# EAGLE design schematc (EAGLE 9.6.1)
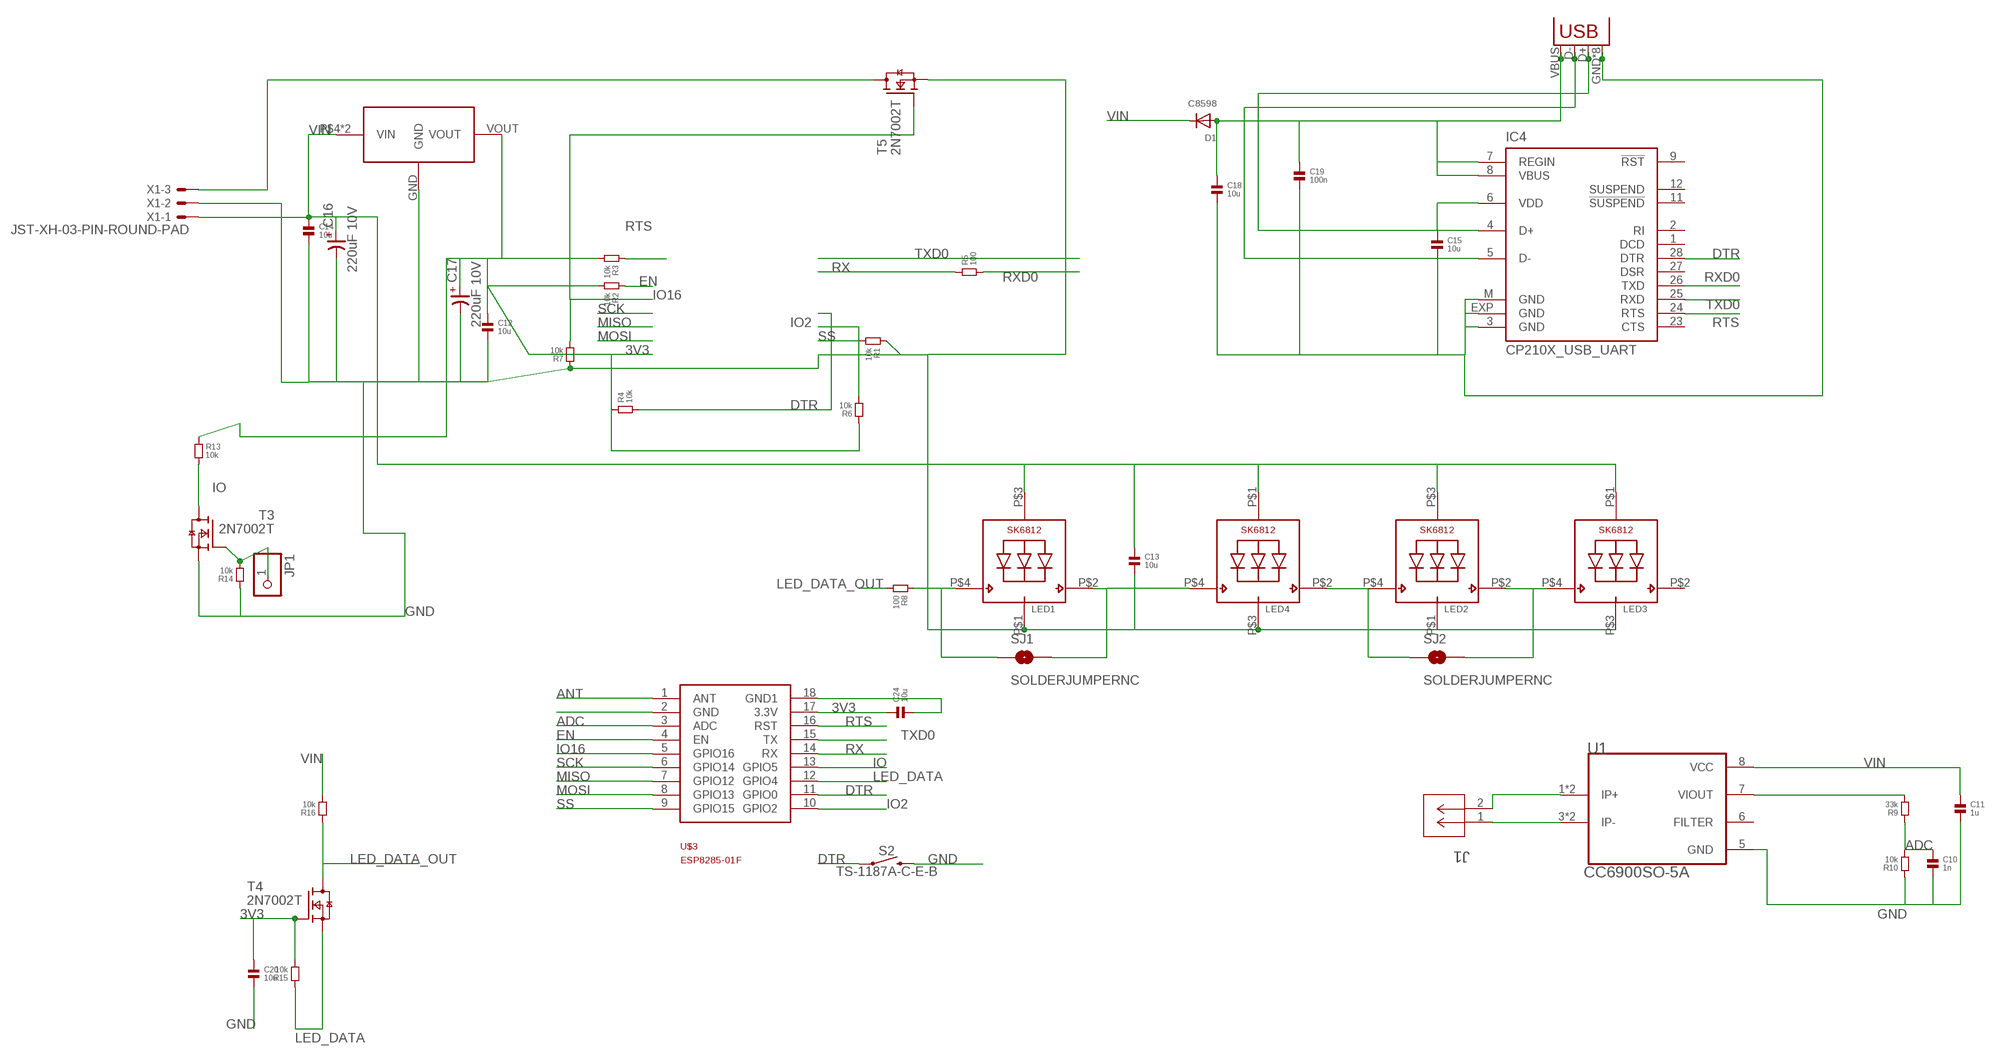
[diagram p0: schematic, sheet 1, part 1 of 2]
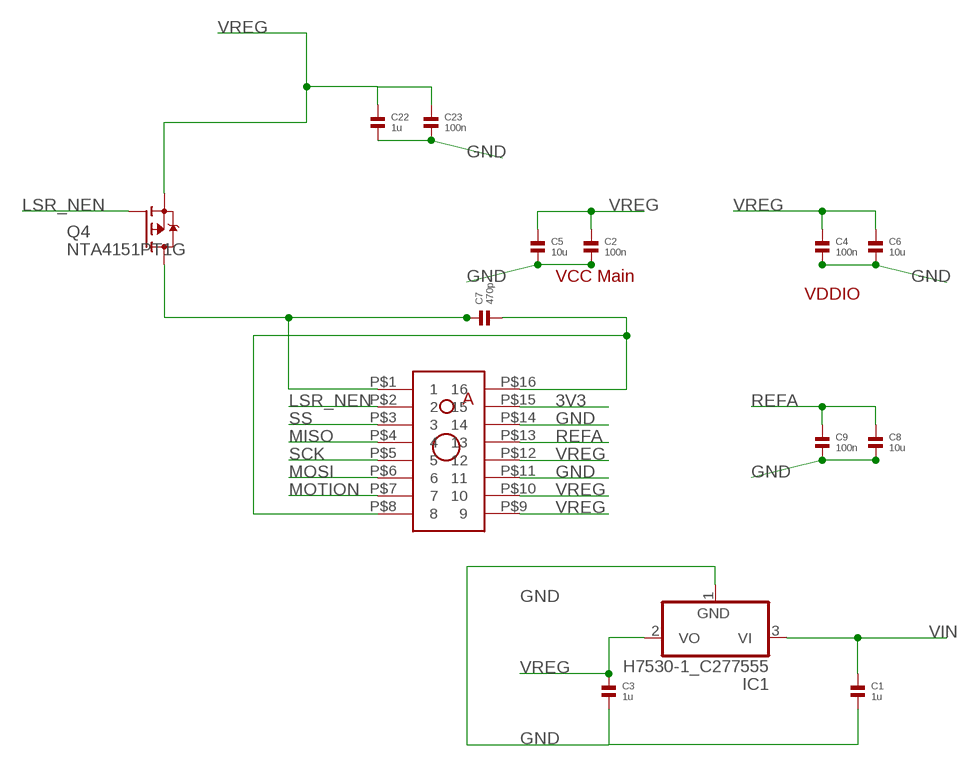
[diagram p1: schematic, sheet 1, part 2 of 2]

## Parts
C1  1u  CAPACITOR.0402  [0402]
C2  100n  CAPACITOR.0402  [0402]
C3  1u  CAPACITOR.0402  [0402]
C4  100n  CAPACITOR.0402  [0402]
C5  10u  CAPACITOR.0402  [0402]
C6  10u  CAPACITOR.0402  [0402]
C7  470p  CAPACITOR.0402  [0402]
C8  10u  CAPACITOR.0402  [0402]
C9  100n  CAPACITOR.0402  [0402]
C10  1n  CAPACITOR.0402  [0402]
C11  1u  CAPACITOR.0402  [0402]
C12  10u  CAPACITOR.0402  [0402]
C13  10u  CAPACITOR.0402  [0402]
C14  10u  CAPACITOR.0402  [0402]
C15  10u  CAPACITOR.0402  [0402]
C16  220uF 10V  CP-3258-TE-B  [3528-TE-B]
C17  220uF 10V  CP-3258-TE-B  [3528-TE-B]
C18  10u  CAPACITOR.0402  [0402]
C19  100n  CAPACITOR.0402  [0402]
C20  10u  CAPACITOR.0402  [0402]
C22  1u  CAPACITOR.0402  [0402]
C23  100n  CAPACITOR.0402  [0402]
C24  10u  CAPACITOR.0402  [0402]
D1  C8598  DIODESOD-123  [SOD-123]
IC1  H7530-1_C277555  MCP1703CB  [SOT23]
IC4  CP210X_USB_UART  [MLP28]
J1  JST  S2B-PH-K-S(LF)(SN)  [CONN_S2B-PH-K-S_JST]
JP1  PINHD-1X1CB  [1X01-CLEANBIG]
LED1  SK6812_SIDE  [LEDSIDE]
LED2  SK6812_SIDE  [LEDSIDE]
LED3  SK6812_2020  [_2020]
LED4  SK6812_2020  [_2020]
Q4  NTA4151PT1G  BSA223SP  [SC75_INFINEON]
R1  10k  RESISTOR.0402  [0402]
R2  10k  RESISTOR.0402  [0402]
R3  10k  RESISTOR.0402  [0402]
R4  10k  RESISTOR.0402  [0402]
R5  100  RESISTOR.0402  [0402]
R6  10k  RESISTOR.0402  [0402]
R7  10k  RESISTOR.0402  [0402]
R8  100  RESISTOR.0402  [0402]
R9  33k  RESISTOR.0402  [0402]
R10  10k  RESISTOR.0402  [0402]
R13  10k  RESISTOR.0402  [0402]
R14  10k  RESISTOR.0402  [0402]
R15  10k  RESISTOR.0402  [0402]
R16  10k  RESISTOR.0402  [0402]
S2  TS-1187A-C-E-B  MOMENTARY-SWITCH-SPST-SMD-5.2-REDUNDANT  [TACTILE_SWITCH_SMD_5.2MM]
SJ1  SOLDERJUMPERNC  [SJ_2S_SMALL]
SJ2  SOLDERJUMPERNC  [SJ_2S_SMALL]
T3  2N7002T  2N7002PT  [SOT416]
T4  2N7002T  2N7002PT  [SOT416]
T5  2N7002T  2N7002PT  [SOT416]
U1  CC6900SO-5A  ACS712ELCTR30AT  [SOIC127P600X175-8N]
U$1  AVAGO_ADNS-9500  [AVAGO_ADNS-9500]
U$3  ESP8285_ESP-01F01F  [ESP8285-01F]
U$5  ME6119  HT7333  [SOT89]
USB1  USBMICROB-PTH  [USB-MICROB-TH]
X1  JST-XH-03-PIN-ROUND-PAD  [JST-XH-03-PACKAGE-ROUND-PAD]

## Nets
3V3 [LED_Power]: C12.1 C17.+ C20.1 C24.1 R2.2 R3.2 R4.1 R6.1 R13.1 R15.2 T4.1(G) U$1.P$15 U$3.17(3.3V) U$5.VOUT
ADC: C10.1 R9.1 R10.2 U$3.3(ADC)
ANT: U$3.1(ANT)
DTR: IC4.28(DTR) R4.2 S2.1 S2.2 U$3.11(GPIO0)
EN: R2.1 U$3.4(EN)
GND: C1.2 C2.2 C3.2 C4.2 C5.2 C6.2 C8.2 C9.2 C10.2 C11.2 C12.2 C13.2 C14.2 C15.2 C16.- C17.- C18.2 C19.2 C20.2 C22.2 C23.2 C24.2 IC1.1(GND) IC4.3(GND) IC4.EXP(GND) IC4.M(GND) LED1.P$1(GND) LED2.P$1(GND) LED3.P$3(GND) LED4.P$3(GND) R1.1 R7.1 R10.1 R14.1 S2.3 S2.4 T3.2(S) T5.2(S) U1.5(GND) U$1.P$11 U$1.P$14 U$3.2(GND) U$3.18(GND1) U$5.GND USB1.GND USB1.ID(GND) USB1.M5(GND) USB1.M6(GND) USB1.MT1(GND) USB1.MT2(GND) USB1.MT3(GND) USB1.MT4(GND) X1.2
IO: R13.2 T3.3(D) U$3.13(GPIO5)
IO2: R6.2 U$3.10(GPIO2)
IO16: R7.2 T5.1(G) U$3.5(GPIO16)
LED_DATA: R15.1 T4.2(S) U$3.12(GPIO4)
LED_DATA_OUT: R8.2 R16.1 T4.3(D)
LSR_NEN: Q4.1(G) U$1.P$2
MISO: U$1.P$4 U$3.7(GPIO12)
MOSI: U$1.P$6 U$3.8(GPIO13)
MOTION: U$1.P$7
N$1: C7.2 U$1.P$8 U$1.P$16
N$2: C7.1 Q4.2(D) U$1.P$1
N$3: J1.2 U1.1(IP+) U1.2(IP+)
N$4: J1.1 U1.3(IP-) U1.4(IP-)
N$5: R9.2 U1.7(VIOUT)
N$6: LED1.P$2(DO) LED4.P$4(DI) SJ1.2
N$7: LED1.P$4(DI) R8.1 SJ1.1
N$8: LED2.P$2(DO) LED3.P$4(DI) SJ2.2
N$9: LED2.P$4(DI) LED4.P$2(DO) SJ2.1
N$10: JP1.1 R14.2 T3.1(G)
N$13: T5.3(D) X1.3
N$46: C18.1 C19.1 D1.A IC4.7(REGIN) IC4.8(VBUS) USB1.VBUS
N$48: C15.1 IC4.6(VDD)
N$52_N: IC4.5(D-) USB1.D-
N$52_P: IC4.4(D+) USB1.D+
REFA: C8.1 C9.1 U$1.P$13
RTS: IC4.24(RTS) R3.1 U$3.16(RST)
RX: R5.1 U$3.14(RX)
RXD0: IC4.26(TXD) R5.2
SCK: U$1.P$5 U$3.6(GPIO14)
SS: R1.2 U$1.P$3 U$3.9(GPIO15)
TXD0: IC4.25(RXD) U$3.15(TX)
VIN [3.3vPower]: C1.1 C11.1 C13.1 C14.1 C16.+ D1.C IC1.3(VI) LED1.P$3(VDD) LED2.P$3(VDD) LED3.P$1(VDD) LED4.P$1(VDD) R16.2 U1.8(VCC) U$5.P$4(VIN) U$5.VIN X1.1
VREG: C2.1 C3.1 C4.1 C5.1 C6.1 C22.1 C23.1 IC1.2(VO) Q4.3(S) U$1.P$9 U$1.P$10 U$1.P$12
Unconnected: IC4.1(DCD) IC4.2(RI) IC4.9(!RST) IC4.11(!SUSPEND) IC4.12(SUSPEND) IC4.23(CTS) IC4.27(DSR) LED3.P$2(DO) U1.6(FILTER)

## Notes on the sheet
- VCC Main
- VDDIO

## Library data of the parts
C1-C15 C18-C20 C22-C24 = standardparts:CAPACITOR
C16 C17 = cap-master:CP-: POLARIZED CAP
D1 = adafruit:DIODE: Diode SMADIODE - SMA Surface Mount Package 20V 1A Schottky Diode Digikey: 641-1014-6-ND DO-1N4148 - Through Hole Small Current Diode SOD-123 20V 1 A (.5mV Vf) Schottky Diode - Digikey: MBRX120TPMSCT-ND SOD-323 10V 570mA (.38mV Vf, 3ns) Schottky Diode - Digikey: ZLLS410CT-ND SOD-523 30V 30mA Schottky Diode (RB751S-40TE61) - Digikey: RB751S-40TE61CT-ND SOT23-R/W - SOT23 Package (R = Solder Paste/Reflow Ovens, W = Hand-Soldering) BAT54Film 40V 300mA - Digikey: 497-7162-1-ND
IC1 = linear:MCP1703: 250 mA, 16V, Low Quiescent Current LDO Regulator Source: http://ww1.microchip.com/downloads/en/DeviceDoc/22049b.pdf
IC4 = SparkFun-DigitalIC:CP210X_USB_UART: Single-Chip USB to UART Bridge Source: www.silabs.com .. CP2101.pdf / cp2102.pdf. Spark Fun Electronics SKU : COM-00310
J1 = 2mm_2Position_JST_RT_TH:S2B-PH-K-S(LF)(SN); BUILT_BY: EMA_Justin; COPYRIGHT: Copyright (C) 2018 Accelerated Designs. All rights reserved; DATASHEET: http://www.jst-mfg.com/product/pdf/eng/ePH.pdf; MANUFACTURER_PART_NUMBER: S2B-PH-K-S(LF)(SN); SOURCELIBRARY: JST_2020-03-24; VENDOR: JST
JP1 = adafruit:PINHD-1X1: Pin header 1x1 for 0.1" spacing With round pins
LED1-LED4 = SK6812:SK6812
Q4 = BSA223SP:BSA223SP: OptiMOS(R)-P Small-Signal-Transistor P-Channel, Enhancement mode, Super Logic Level (2.5 V rated) Source: http://www.infineon.com/upload/Document/BSA223SP_Rev1.3.pdf; AVAILABILITY: Unavailable; DESCRIPTION: P-Channel 20V 390mA _Ta_ 250mW _Ta_ Surface Mount PG-SC-75; MF: Infineon Technologies; MP: BSA223SP; PACKAGE: SOT-416 Infineon Technologies; PRICE: None
R1-R10 R13-R16 = standardparts:RESISTOR
S2 = SparkFun-Switches:MOMENTARY-SWITCH-SPST: Momentary Switch (Pushbutton) - SPST Normally-open (NO) SPST momentary switches (buttons, pushbuttons). Variants PTH-12MM - 12mm square, through-hole Momentary Pushbutton Switch - 12mm Square <https://www.sparkfun.com/products/9190> (COM-09190) PTH-6.0MM, PTH-6.0MM-KIT - 6.0mm square, through-hole Mini Pushbutton Switch <https://www.sparkfun.com/products/97> (COM-00097) KIT package intended for soldering kit's - only one side of pads' copper is exposed. PTH-RIGHT-ANGLE-KIT - Right-angle, through-hole Right Angle Tactile Button <https://www.sparkfun.com/products/10791> - Used on SparkFun BigTime Watch Kit <https://www.sparkfun.com/products/11734> SMD-12MM - 12mm square, surface-mount Tactile Button - SMD (12mm) <https://www.sparkfun.com/products/12993> (COM-12993) Used on SparkFun PicoBoard <https://www.sparkfun.com/products/11888> SMD-4.5MM - 4.5mm Square Trackball Switch Used on SparkFun Blackberry Trackballer Breakout <https://www.sparkfun.com/products/13169> SMD-4.6MMX2.8MM - 4.60mm x 2.80mm, surface mount Used on SparkFun SAMD21 Mini Breakout <https://www.sparkfun.com/products/13664> SMD-5.2MM, SMD-5.2-REDUNDANT - 5.2mm square, surface-mount Mini Pushbutton Switch - SMD <https://www.sparkfun.com/products/8720> (COM-08720) Used on Arduino Pro Mini <https://www.sparkfun.com/products/11114> REDUNDANT package connects both switch circuits together SMD-6.0X3.5MM - 6.0 x 3.5mm, surface mount Momentary Reset Switch SMD <https://www.sparkfun.com/products/8229> (COM-08229) SMD-6.2MM-TALL - 6.2mm square, surface mount Tactile Button - SMD (6mm) <https://www.sparkfun.com/products/12992> Used on SparkFun Digital Sandbox <https://www.sparkfun.com/products/12651> SMD-RIGHT-ANGLE - Right-angle, surface mount Used on SparkFun Block for Intel® Edison - Arduino <https://www.sparkfun.com/products/13036>; PROD_ID: SWCH-08247; SF_SKU: COM-08720
SJ1 SJ2 = headers:SOLDERJUMPER: Solder Jumper Standard SMD solder jumper. Used to automate production. Two varients : Normally Open and Normally Closed are the same, but have different paste layers. NC will have a large amount of paste and should jumper during reflow.
T3-T5 = nxp_60:2N7002: N-channel TrenchMOS FET N-channel enhancement mode Field-Effect Transistor (FET) in a plastic package using TrenchMOS technology. AAL Eindhoven MK
U1 = ACS712ELCTR30AT:ACS712ELCTR30AT: Sensor: current; Package: SO8; Usup: 4.5÷5.5VDC; Iin: ± 30A; 66mV; AVAILABILITY: Unavailable; DESCRIPTION: Current Sensor 30A 1 Channel Hall Effect, Open Loop Bidirectional 8-SOIC _0.154, 3.90mm Width_; MF: Allegro MicroSystems LLC; MP: ACS712ELCTR30AT; PACKAGE: SOIC-8 Allegro MicroSystems LLC; PRICE: None
U$1 = JKCustom:AVAGO_ADNS-9500
U$3 = ESP8266-ESP12:ESP8285_ESP-01F
U$5 = HT7333_SOT89:HT7333
USB1 = Ai_Connectors:USB
X1 = JST XH Connectors v1-0:JST-XH-03-PIN: JST XH Connector 2 Pin Wire to board connector. Pitch: 2,54 mm, (0.100") Number of pins: 3 Created by Rembrandt Electronics www.rembrandtelectronics.com

## Net classes
2 LED_Power: width 0.178 mm, clearance 0.127 mm
3 3.3vPower: width 0.178 mm

## Board
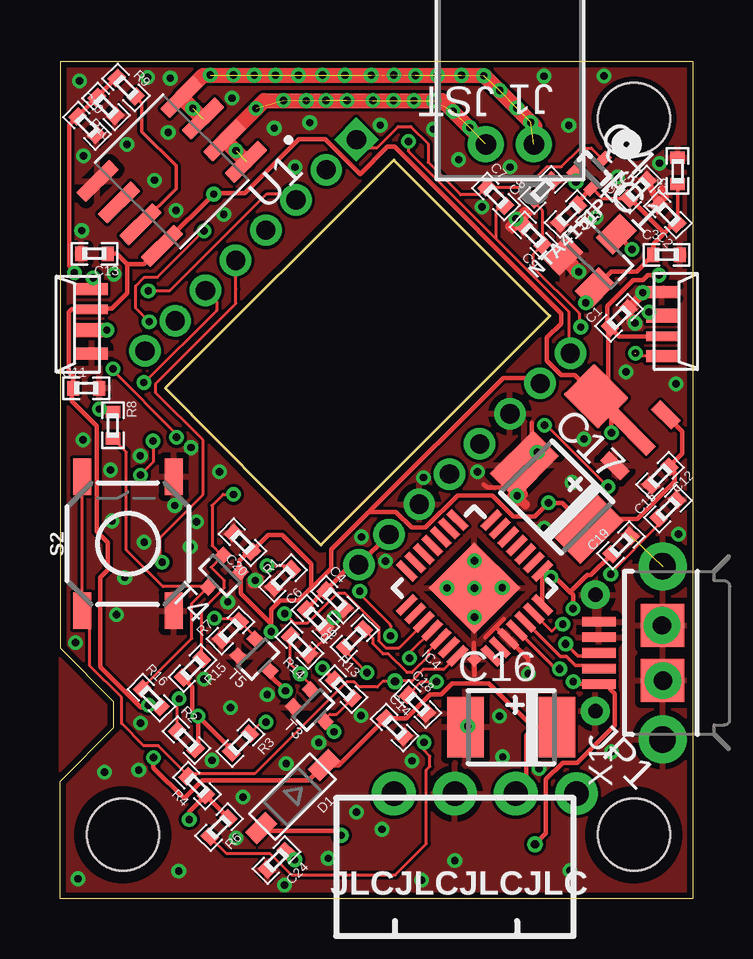
[diagram p2: board, top side]
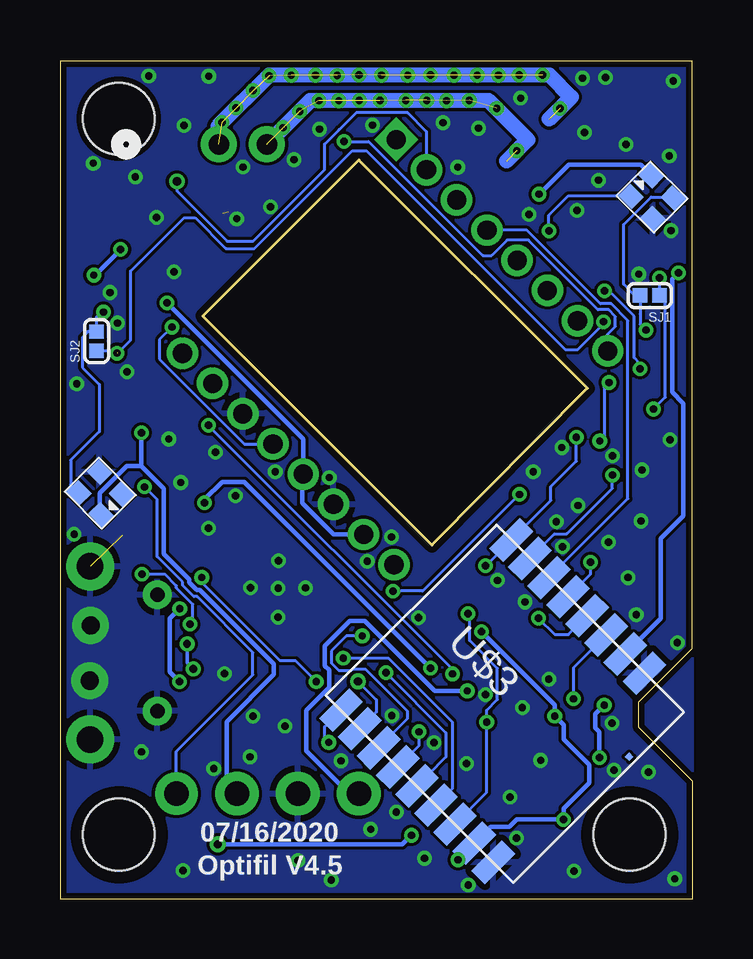
[diagram p3: board, bottom side, seen from below]

Size 26.37 x 34.91 mm. Coordinates in mm from the lower left corner, seen from the top.
Outline: 0.03,34.91 26.36,34.91 26.36,0 0,0 0,4.89 2.25,7.14 2.25,8.21 0.03,10.43 0.03,34.91
Copper layers (1*16): Top 0.035mm / dielectric 1.5mm / Bottom 0.035mm
Design rules "LP_PCBOrder": minimum track width 5mil, minimum drill 12mil, track to track 5mil, track to pad 5mil, pad to pad 5mil, via to via 5mil, smd to smd 0mil, copper to edge 10mil, drill to drill 10mil, minimum pad ring 10mil, minimum via ring 6mil, stop-mask expansion 2mil, vias tented up to drill 17mil, thermal gap 10mil
Holes 3 mm at 2.63,2.67 23.92,2.67 23.92,32.52
tRestrict: area 2.3,2.4 to 2.9,3; area 23.6,2.4 to 24.2,3; area 4.1,14.4 to 20.7,31
bRestrict: area 2.3,2.4 to 2.9,3; area 23.6,2.4 to 24.2,3; area 4.1,14.4 to 20.7,31

### Footprints (pad centres in the part's own frame; a part is rotated, then mirrored left to right if it is on the bottom)
0402 = smd 0.5 x 0.6: 1 -0.55,0; 2 0.55,0
3528-TE-B = smd 1.524 x 2.54: + 1.905,0; - -1.905,0
SOD-123 = smd 1.2 x 0.7: A 1.85,0; C -1.85,0
SOT23 = smd 1 x 1.4: 1 -0.95,-1.1; 2 0.95,-1.1; 3 0,1.1
MLP28 = smd 1 x 0.3: 1 -2.5,1.5; 2 -2.5,1; 3 -2.5,0.5; 4 -2.5,0; 5 -2.5,-0.5; 6 -2.5,-1; 7 -2.5,-1.5; 15 2.5,-1.5; 16 2.5,-1; 17 2.5,-0.5; 18 2.5,0; 19 2.5,0.5; 20 2.5,1; 21 2.5,1.5 | smd 0.3 x 1: 8 -1.5,-2.5; 9 -1,-2.5; 10 -0.5,-2.5; 11 0,-2.5; 12 0.5,-2.5; 13 1,-2.5; 14 1.5,-2.5; 22 1.5,2.5; 23 1,2.5; 24 0.5,2.5; 25 0,2.5; 26 -0.5,2.5; 27 -1,2.5; 28 -1.5,2.5 | smd 2.7 x 2.7: EXP 0,0 | smd 0.435 x 0.435: M -2.103,2.103
CONN_S2B-PH-K-S_JST = drill 0.85 pad 1.5: 1 0,0; 2 2.007,0
1X01-CLEANBIG = drill 1.016 pad 1.778: 1 0,0
LEDSIDE = smd 1.3 x 0.5: P$1 -0.212,1.905; P$4 -0.212,-0.77 | smd 1.3 x 0.6: P$2 -0.212,0.927 | smd 1.3 x 0.4: P$3 -0.212,0.058
_2020 = smd 0.8 x 0.7: P$1 0.65,-0.6; P$2 0.65,0.6; P$3 -0.65,0.6; P$4 -0.65,-0.6
SC75_INFINEON = smd 0.4 x 0.65: 1 -0.5,-0.575; 2 0,0.575; 3 0.5,-0.575
TACTILE_SWITCH_SMD_5.2MM = smd 1.524 x 0.762: 1 -2.794,1.905; 2 2.794,1.905; 3 -2.794,-1.905; 4 2.794,-1.905
SJ_2S_SMALL = smd 0.6 x 0.6: 1 -0.4,0; 2 0.4,0
SOT416 = smd 0.5 x 0.6: 1 -0.5,-0.65; 2 0.5,-0.65; 3 0,0.65
SOIC127P600X175-8N = smd 1.97 x 0.6: 1 -2.475,1.905; 2 -2.475,0.635; 3 -2.475,-0.635; 4 -2.475,-1.905; 5 2.475,-1.905; 6 2.475,-0.635; 7 2.475,0.635; 8 2.475,1.905
AVAGO_ADNS-9500 = drill 0.8 pad 1.3 square: P$1 0,0 | drill 0.8 pad 1.3: P$2 -1.78,0; P$3 -3.56,0; P$4 -5.34,0; P$5 -7.12,0; P$6 -8.9,0; P$7 -10.68,0; P$8 -12.46,0; P$9 -12.46,-12.6; P$10 -10.68,-12.6; P$11 -8.9,-12.6; P$12 -7.12,-12.6; P$13 -5.34,-12.6; P$14 -3.56,-12.6; P$15 -1.78,-12.6; P$16 0,-12.6
ESP8285-01F = smd 0.254 x 0.254: 1 -4.701,-0.696 | smd 1.778 x 0.8: 2 -7.624,-2.709; 3 -7.624,-3.834; 4 -7.624,-4.96; 5 -7.624,-6.085; 6 -7.624,-7.21; 7 -7.624,-8.335; 8 -7.624,-9.46; 9 -7.624,-10.553; 10 2.407,-10.553; 11 2.407,-9.46; 12 2.407,-8.335; 13 2.407,-7.21; 14 2.407,-6.085; 15 2.407,-4.96; 16 2.407,-3.834; 17 2.407,-2.709; 18 2.407,-1.585
SOT89 = smd 0.559 x 1.194: GND -1.499,-0.597; VOUT 1.499,-0.597 | smd 1.829 x 2.032: P$4 0,2.007 | smd 0.559 x 2.286: VIN 0,-0.089
USB-MICROB-TH = smd 0.4 x 1.4: D+ 0,2.65; D- -0.65,2.65; GND 1.3,2.65; ID 0.65,2.65; VBUS -1.3,2.65 | smd 1.8 x 1.8: M5 -1.15,0; M6 1.15,0 | drill 0.6 pad 1.2: MT1 -2.425,2.8; MT2 2.425,2.8 | drill 1.1 pad 2: MT3 -3.61,0; MT4 3.61,0
JST-XH-03-PACKAGE-ROUND-PAD = drill 1.016 pad 1.829: 1 -2.54,0; 2 0,0; 3 2.54,0

### Placement (x,y rotation side)
C1  23.3,24.22 45 top
C2  25.33,28.52 135 top
C3  25.28,26.84 0 top
C4  11.45,12.46 315 top
C5  25.73,30.34 90 top
C6  10.64,11.68 315 top
C7  18.16,29.27 315 top
C8  20.11,29.54 45 top
C9  19.72,27.64 135 top
C10  1.12,32.22 315 top
C11  1.09,21.28 0 top
C12  25,17.62 225 top
C13  1.44,26.89 180 top
C14  13.94,7.13 315 top
C15  25.32,16.24 45 top
C16  18.8,7.15 0 top
C17  20.7,16.74 315 top
C18  14.89,8.11 315 top
C19  23.38,14.74 45 top
C20  7.6,14.86 135 top
C22  24.09,29.57 45 top
C23  21.19,28.54 225 top
C24  9.02,1.6 225 top
D1  9.69,4.25 225 top
IC1  22.4,26.92 315 top
IC4  17.27,12.95 135 top
J1  19.75,31.45 180 top
JP1  21.52,4.38 315 top
LED1  1.12,24.63 180 top
LED2  25.29,23.38 0 top
LED3  24.69,16.9 315 bottom
LED4  1.7,29.25 135 bottom
Q4  22.22,30.4 315 top
R1  9.28,13.35 45 top
R2  5.27,6.62 315 top
R3  7.52,6.49 225 top
R4  5.7,4.71 135 top
R5  12.26,10.85 45 top
R6  6.63,2.97 225 top
R7  7.1,11.17 45 top
R8  2.2,19.73 270 top
R9  2.75,33.83 315 top
R10  1.92,33.02 135 top
R13  11.8,8.74 315 top
R14  9.98,10.57 135 top
R15  5.52,9.61 225 top
R16  3.8,8.37 315 top
S2  2.83,14.8 90 top
SJ1  1.79,25.15 180 bottom
SJ2  24.84,23.24 90 bottom
T3  10.56,7.87 225 top
T4  6.66,13.47 135 top
T5  8.26,9.99 225 top
U1  4.66,30.32 225 top
U$1  12.35,31.64 45 top
U$3  5.49,2.1 225 bottom
U$5  23.76,19.53 45 top
USB1  25.11,10.25 90 top
X1  16.45,4.38 180 top

### Tracks (layer width: path | path; a pad name or v marks a point on that pad's centre or on a via)
3V3  (via drill 0.3, 0.3 pad 0.61)
  Top 0.178: v8.8,11.13 8.8,11.46 | 8.8,11.46 8.8,12.06 9.17,12.43 9.96,12.43 11.29,13.77 11.29,14.55 12.87,16.13 12.92,16.13 | 12.92,16.13 14,16.13 14.66,15.46 15.23,15.46 16.57,16.81 18.01,16.81 18.89,15.93 19.78,15.93 v20.35,16.5 20.93,16.5 C17.+ 22.46,14.97 23.32,15.84 24.06,15.84 25.61,17.39 25.61,17.79 C12.1 25.93,18.55 25.93,19.47 U$5.VOUT | R3.2 7.13,6.23 v5.75,7.61 | v10.93,9.61 R13.1 | R6.1 6.09,4.29 R4.1 5.38,3.62 v5.38,3.3 | 8.8,11.46 7.53,12.72 7.53,13.52 T4.1 7.48,14.09 7.86,14.47 C20.1 8.67,15.15 9.26,15.15 10.46,13.95 10.46,12.93 | C24.1 v9.77,1.62 v9.78,1.62 | v5.75,7.61 5.51,7.85 5.51,8.84 R15.2 | R2.2 5.75,6.32 v5.75,7.61 | R15.2 | U$1.P$15 19.77,21.71 18.46,21.71 12.92,16.17 12.92,16.13
  Bottom 0.178: v8.8,11.13 v8.8,11.12 5.75,8.08 v5.75,7.61 5.38,7.24 5.38,6.64 4.31,5.57 4.31,4.83 5.38,3.76 v5.38,3.3 7.34,3.3 7.64,3 8.42,3 U$3.17 9.78,1.64 v9.78,1.62 | v20.35,16.5 20.35,16.64 19.61,17.38 18.7,17.38 v10.93,9.61
ADC  (via drill 0.3)
  Top 0.178: R9.1 2.34,34.22 R10.2 C10.1 0.38,32.26 0.38,26.38 0.6,26.16 v0.6,26.09
  Bottom 0.178: U$3.3 1.33,11.68 1.33,15.01 0.39,15.95 0.39,20.65 0.86,21.12 0.86,25.82 v0.6,26.09
DTR  (via drill 0.35)
  Top 0.127: IC4.28 15.99,9.55 15.14,9.55 14.67,9.08 13.97,9.08 v13.95,9.06 13.45,9.06 13.22,8.83 12.46,8.83 12.26,9.03 11.94,9.03 8.12,5.21 5.42,5.21 R4.2 5.3,5.09 5.29,5.1 5.29,5.19 4.1,6.38 3.49,6.38 2.57,7.3 2.57,8.38 1.24,9.7 1.24,11.68 S2.1 S2.2
  Bottom 0.127: U$3.11 13.18,7.78 13.18,8.29 v13.95,9.06
EN  (via drill 0.3)
  Top 0.127: R2.1 4.88,8.24 v4.97,8.33
  Bottom 0.127: v4.97,8.33 4.97,9.64 U$3.4
GND  (via drill 0.3 pad 0.61, 0.76 pad 1.52)  (2 unrouted)
  Top 0.127: C6.2 11.25,11.06 R14.1 | 24.69,17.15 C12.2 | USB1.GND 22.43,11.52 | 20.59,29.84 C8.2
  Top 0.178: 18.5,11.66 18.16,11.33 | 17.73,10.89 18.16,11.33 | 17.65,17.27 17.79,17.13 18.4,17.13 C17.- 19.66,18.39 19.66,19.85 | 18.83,27.8 19.58,28.55 | v19.51,9.39 19.51,10 IC4.3 18.66,10.83 18.16,11.33 | IC4.M 17.27,9.34 17.27,9.33 17.25,10.67
  Top 0.2: v19,28.35 19,28.13 18.9,28.03 18.76,28.03
  Top 0.305: 7.99,13.1 8.18,13.1 8.34,13.25 8.32,13.27 8.32,13.37 | C2.2 C22.2 | 25.21,29.24 25.09,29.59
  Top 0.381: 19.41,16.42 19.24,16.59 19.04,16.59 19.32,16.87 19.23,16.96 19.08,16.96 18.88,16.76 18.78,16.76 18.78,16.62 18.95,16.46 | C1.2 23.69,24.63 24.24,25.18 24.46,25.32 LED2.P$1
  Top 0.406: 19.35,28.63 18.76,28.03
  Top 0.61: 21.58,26.15 21.21,26.52 | 23.99,23.96 23.9,24.05
  other vias: 6.99,12.37 18.32,7.61 12.35,3.61 15.07,0.78 13.56,14.07 25.77,15.19 13.42,2.89 17.27,14.09 16.13,12.95 19.89,18.61 23.58,21.96 6.65,17.79 7.34,2.53 11.42,11.71 2.79,31.44 7.17,33.37 10.41,32.35 4.6,34.2 0.75,0.83 8.14,13.27 2.35,11.84 2.11,17.87 20.18,15.44 22.97,6.12 15.56,32.08 18.43,12.96 17.28,11.74 2.16,15.74 0.64,10.67 16.45,1.59 21.25,1.17 17.27,12.95 25.09,11.39 25.12,9.09 16.99,7.2 19.05,16.8 8.93,32.12 8.64,8.51 7.62,4.23 7.1,7.97 0.91,27.85 3.64,34.23 24.98,30.66 23.23,30.09 12.56,15.08 17.4,17.79 4.51,31.94 0.82,34.09 4.95,1.15 1.85,5.27 9.79,30.49 9.35,0.56 6.34,5.77 4.78,16.39 6,9.15 3.36,7.32 3.28,5.36 2.7,13.39 5.68,15.71 14.66,5.74 12.54,7.64 11.18,1.68 9.42,5.64 10.78,6.5 19.96,5.42 18.44,5.91 17.59,28.84 0.95,19.12 6.82,28.52 3.34,18.46 3.51,14.86 5.42,14.68 13.35,32.25 5.46,18.81 16.61,30.81 18.74,30.5 21.2,32.23 20.17,34.29 22.67,34.3 21.84,19.16 21.33,17.35 15.15,17.55 25.67,21.47 22.34,28.4 21.61,26.13 23.96,23.99 2.25,26.03 24.28,25.26 4.83,28.69 0.98,30.96 3.93,29.95
  pour Top: 0,34.88 26.4,34.88 26.4,0.04 0,0.04
  pour Bottom: 0,34.88 26.4,34.88 26.4,0.04 0,0.04
IO  (via drill 0.3 pad 0.61)
  Top 0.127: R13.2 11.52,7.68 11.24,7.68 11.02,7.46 T3.3 11.41,7.01 v11.41,6.96
  Bottom 0.127: v11.41,6.96 11.41,6.37 U$3.13
IO2  (via drill 0.3)
  Top 0.127: R6.2 6.24,2.57 6.93,1.88 8.75,1.88 9.64,0.99 13.97,0.99 15.27,2.29 15.27,5.37 15.41,5.51 15.41,5.94 15.17,6.19 v15.17,6.52
  Bottom 0.127: U$3.10 14.94,7.57 15.34,7.17 15.34,6.69 v15.17,6.52
IO16  (via drill 0.3 pad 0.61)
  Top 0.127: v6.43,11.69 7.36,11.69 R7.2 8.16,10.89 T5.1
  Bottom 0.127: v6.43,11.69 5.75,11.01 5.18,11.01 4.83,11.36 | 4.83,11.36 | U$3.5 4.83,11.36
LED_DATA  (via drill 0.3 pad 0.61)
  Top 0.127: v12.49,12.82 12.49,12.7 13.74,11.45 13.74,11.42 13.77,11.38 v13.77,10.95 | v7.22,16.85 6.8,16.85 6.34,16.39 6.34,14.72 T4.2 6.29,13.81 6.85,13.26 6.85,12.95 5.91,12.02 R15.1
  Bottom 0.127: v12.49,12.82 11.25,12.82 v7.22,16.85 | v13.77,10.95 14.43,10.95 15.06,10.32 15.06,9.82 14.74,9.51 14.24,9.51 14.17,9.58 13.64,9.58 11.89,7.82 11.89,7.5 U$3.12
LED_DATA_OUT
  Top 0.127: R16.1 5.5,10.84 5.5,12.31 T4.3 4.28,13.01 2.76,14.53 2.76,18.62 R8.2
LSR_NEN  (via drill 0.35)
  Top 0.127: Q4.1 21.46,29.94 v21.49,29.9
  Bottom 0.127: v21.49,29.9 21.49,29.51 19.4,27.41 18.31,27.41 15.34,30.39 15.34,31.46 14.73,32.06 14.72,32.06 14.02,32.76 11.88,32.76 11.09,31.97 U$1.P$2
MISO
  Bottom 0.127: U$3.7 2.7,16.68 2.7,24.1 3.41,24.8 3.84,24.8 6.91,27.87 U$1.P$4
MOSI  (via drill 0.3, 0.3 pad 0.61)
  Top 0.127: v3.35,17.66 v3.35,17.67 3.9,18.22 3.9,19.08 v3.87,19.08 | U$1.P$6 6.53,24.88 6.53,24.52 3.52,21.51 v3.49,21.51
  Bottom 0.127: U$3.8 5.76,15.21 5.25,15.21 3.35,17.11 v3.35,17.66 | v3.87,19.08 3.7,19.25 3.7,21.31 v3.49,21.51
N$1  (via drill 0.3 pad 0.61)
  Top 0.127: 18.18,27.5 21.19,24.48 21.19,22.81 U$1.P$16 | 18.18,27.5 18.18,28.71 18.36,28.88 C7.2 | v14.53,31.57 14.53,31.15 18.18,27.5
  Bottom 0.127: v14.53,31.57 | v14.53,31.57 13.5,31.57 8.75,26.81 8.38,26.81 7.73,27.45 6.85,27.45 3.95,24.55 3.51,24.55 3.22,24.26 3.22,23.85 3.54,23.53 U$1.P$8
N$2
  Top 0.127: Q4.2 22.14,31.29 21.68,31.29 20.89,30.51 20.27,30.51 19.43,29.66 19.41,29.66 C7.1 17.45,29.35 16.69,29.35 15.34,30.7 15.34,31.47 14.62,32.19 14.09,32.19 13.19,31.29 12.71,31.29 U$1.P$1
N$3  (via drill 0.3)  (13 unrouted)
  Top 0.61: J1.2 15.92,33.27
  Top 0.635: U1.1 U1.2 8.5,33.27 15.92,33.27
  Bottom 0.635: 7.76,30.75 6.87,31.64 8.51,33.27 15.94,33.27 17.84,31.37
  other vias: 17.07,32.14 16.37,32.82 15.57,33.27 14.75,33.27 13.89,33.27 13.04,33.27 11.96,33.28 11.08,33.28 10.26,33.27 9.31,33.28 8.17,32.94 7.34,31.18
N$4  (via drill 0.3)  (18 unrouted)
  Top 0.61: 19.79,32.19 19.79,31.48 J1.1
  Top 0.635: U1.3 U1.4 5.97,34.32 17.66,34.32 19.79,32.19
  Bottom 0.635: 5.98,32.5 U1.4 5.97,34.33 17.65,34.33 19.79,32.19 19.79,31.39
  other vias: 19.61,32.36 19.03,32.96 18.32,33.69 17.65,34.31 16.73,34.33 15.72,34.33 14.81,34.32 13.91,34.34 12.97,34.33 11.88,34.33 10.93,34.34 9.94,34.33 8.98,34.33 8.09,34.33 7.23,34.33 6.26,34.33 5.53,32.95
N$5
  Top 0.152: U1.7 4.83,29.6 4.83,30.55 3.41,31.98 3.41,33.17 R9.2
N$6  (via drill 0.3)
  Top 0.127: v1.95,23.71 LED1.P$2
  Bottom 0.127: 2.19,24.38 SJ1.2 2.42,25.15 2.88,25.61 2.88,28.1 1.73,29.25 0.85,29.25 LED4.P$4 | 2.19,24.38 | v1.95,23.71 2.19,23.95 2.19,24.38
N$7  (via drill 0.3)
  Top 0.127: R8.1 1.79,20.28 1.66,20.41 v1.64,20.41 | LED1.P$4 1.33,25.83 v1.38,25.88
  Bottom 0.127: v1.64,20.41 1.14,20.9 1.14,24.91 SJ1.1 | SJ1.1 | SJ1.1 v1.38,25.88
N$8  (via drill 0.3)
  Top 0.127: 24.73,24.18 24.85,24.31 LED2.P$2 24.69,24.31 v24.55,24.45
  Bottom 0.127: v24.55,24.45 24.65,24.45 24.84,24.26 SJ2.2 25.19,23.64 25.44,23.39 25.44,22.15 24.73,21.44 24.73,19.47 25.92,18.28 25.92,17.28 LED3.P$4
N$9  (via drill 0.3)  (1 unrouted)
  Top 0.127: 24.94,22.74 LED2.P$4 24.12,22.61 v23.99,22.74 | v3.72,24.05 3.15,24.62 3.15,25.54 3.51,25.9 4.06,25.9 v5.99,27.84
  Bottom 0.127: 23.96,22.74 23.42,23.28 23.42,26.16 21.2,28.39 20.74,28.39 19.46,27.1 18.26,27.1 14.19,31.18 13.6,31.18 5.31,22.89 4.8,22.89 3.72,23.97 v3.72,24.05 | v5.99,27.84 5.99,28.49 5.18,29.3 2.6,29.3 LED4.P$2 | SJ2.1 24.09,22.84 v23.99,22.74
N$10  (via drill 0.3, 0.3 pad 0.61)
  Top 0.127: 20.18,19.67 20.18,19.7 | 20.18,19.7 v20.18,19.73 | R14.2 9.59,9.78 v10.01,9.37 10.45,8.92 T3.1 | v22.84,17.16 20.31,19.7 20.18,19.7
  Bottom 0.127: v10.01,9.37 9.82,9.37 v20.18,19.73 | JP1.1 21.52,6.14 18.33,9.33 18.33,10.26 20.66,12.59 20.79,12.59 21.26,13.06 21.26,13.19 22.32,14.26 22.32,16.65 v22.84,17.16
N$13  (via drill 0.3)
  Top 0.178: v9.4,8.66 8.72,9.34 T5.3
  Bottom 0.178: v9.4,8.66 10.74,8.66 13.66,11.58 14.29,11.58 15.34,10.54 15.34,9.71 15.16,9.53 15.16,8.8 16.1,7.85 16.1,6.17 14.32,4.38 X1.3
N$46  (via drill 0.3, 0.3 pad 0.61, 0.35)
  Top 0.127: C18.1 15.06,9.05 v15.69,9.05 | v20.46,13.39 20.19,13.66 IC4.8
  Top 0.178: v21.38,9.05 21.49,8.95 22.33,8.95 USB1.VBUS 22.72,8.95 23.12,8.54 23.12,7.23 21.56,5.66 20.94,5.66 20.24,4.97 20.24,2.72 v19.79,2.27 | v21.38,12.09 21.38,12.66 21.18,12.85 | v20.46,13.39 20.64,13.39 21.18,12.85 | IC4.7 IC4.8 | C19.1 22.12,13.49 21.97,13.49 21.33,12.85 21.18,12.85 | D1.A 8.49,2.95 8.61,2.83 11.54,2.83 v11.72,2.64
  Bottom 0.127: v15.69,9.05 16.55,9.92 17.19,9.92 20.46,13.19 v20.46,13.39
  Bottom 0.178: v21.38,9.05 21.78,9.45 21.78,11.69 v21.38,12.09 | v11.72,2.64 12.09,2.27 v19.79,2.27
N$48  (via drill 0.3 pad 0.61)
  Top 0.127: v20.95,11.44 20.78,11.44 20.49,11.15 IC4.6 | v22.95,13.53 22.95,13.58 24.94,15.57 C15.1
  Bottom 0.127: v20.95,11.44 20.83,11.55 20.83,12.27 21.51,12.95 21.51,13.04 22,13.53 v22.95,13.53
N$52_N
  Top 0.14: IC4.5 19.4,11.54 20.84,10.1 21.1,10.1 21.47,9.72 22.33,9.72 USB1.D-
N$52_P  (via drill 0.32)
  Top 0.14: IC4.4 19.06,11.18 20.66,9.58 v20.81,9.58 | USB1.D+ 22.33,10.12 21.57,10.12 v21.07,10.62
  Bottom 0.14: v21.07,10.62 21.07,9.83 v20.81,9.58
REFA  (via drill 0.3 pad 0.61)
  Top 0.127: C8.1 19.68,29.11 20.11,28.67 C9.1 19.7,26.85 19.7,26.34 21.63,24.41 21.63,23.89 v21.7,23.83
  Bottom 0.127: v21.7,23.83 22.23,23.3 22.23,22.5 18.68,18.96 U$1.P$13
RTS  (via drill 0.3, 0.3 pad 0.61)
  Top 0.127: v9.36,11.88 9.76,11.48 10.32,11.48 11.58,12.74 11.86,12.74 13.28,11.33 13.28,10.75 13.57,10.46 14.13,10.46 15.15,11.47 IC4.24 | R3.1 8.38,7.35 v8.58,7.35
  Bottom 0.127: U$3.16 8.58,4.43 v8.58,7.35 8.58,7.86 8.14,8.3 8.14,9.6 9.29,10.75 9.29,11.81 v9.36,11.88
RX  (via drill 0.3 pad 0.61)
  Top 0.127: v12.79,9.42 11.87,10.34 R5.1
  Bottom 0.127: v12.79,9.42 10.28,6.92 10.28,5.91 11.04,5.15
  Bottom 0.178: 11.04,5.15 U$3.14
RXD0
  Top 0.127: R5.2 13.02,10.87 13.02,10.64 13.46,10.2 13.69,10.2 14.46,9.43 14.66,9.43 15.36,10.13 15.36,10.33 IC4.26
SCK  (via drill 0.3)
  Top 0.127: U$1.P$5 7.33,25.42 7.33,24.81 3.99,21.47 3.99,21.08 5.96,19.11 5.96,16.86 4.17,15.06 4.17,14.11 v4.26,14.02
  Bottom 0.127: U$3.6 4.26,13.53 v4.26,14.02
SS  (via drill 0.3, 0.3 pad 0.61)
  Top 0.127: v8.63,13.88 v8.64,13.89 9.53,13.89 R1.2 | v4.85,19.23 4.85,19.38 2.2,22.03 v2.2,22.09 | U$1.P$3 9.57,29.39 8.62,29.39 4.57,25.34 v3.68,25.34
  Bottom 0.127: v8.63,13.88 | v8.63,13.88 | v8.63,13.88 U$3.9 5.91,16.6 5.91,17.18 4.85,18.24 v4.85,19.23 | v2.2,22.09 2.2,22.31 2.44,22.55 2.44,24.28 3.51,25.34 v3.68,25.34
TXD0  (via drill 0.3 pad 0.61)
  Top 0.127: v14.56,10.03 14.56,10.24 IC4.25
  Bottom 0.127: v14.56,10.03 12.69,10.03 10.03,7.37 10.03,4.57 10.29,4.31
  Bottom 0.178: U$3.15 10.29,4.31
VIN  (via drill 0.3)
  Top 0.178: U$5.P$4 21.45,21.84 20.88,21.84 20.29,22.42 20.29,23.38 20.89,23.98 20.89,24.39 13.94,31.34 13.64,31.34 12.51,30.21 11.05,31.67 9.95,31.67 7.69,29.41 6.44,29.41 v6.4,29.37 4.35,27.32 U1.8 3.49,26.45 2.79,26.45 | U$5.P$4 22.56,20.72 U$5.VIN 22.49,20.8 22.49,21.1 | X1.1 19.44,4.82 19.44,6.81 19.78,7.15 C16.+ 19.7,7.15 17.87,8.98 16.35,8.98 15.89,8.52 15.42,8.52 14.42,7.52 C14.1 13.55,7.49 11.62,5.56 D1.C 10.36,4.93 5.92,4.93 5.17,4.18 3.89,5.46 v3.89,5.88 | v3.69,8.07 3.77,7.98 R16.2 3.36,7.98 1.68,9.66 1.68,13.39 1.99,13.7 1.99,14.85 1.54,15.3 1.54,19.71 0.5,20.75 0.5,21.23 C11.1 0.54,21.78 0.37,21.95 0.37,24.46 0.48,24.58 LED1.P$3 1.36,24.6 2.16,24.6 2.79,25.24 2.79,26.45 | U$5.P$4 22.49,21.1 | 22.49,21.1 22.83,21.44 22.83,23.75 C1.1 | LED2.P$3 23.3,23.44 C1.1 | IC1.3 v23.84,27.06 | C1.1 22.8,23.95 22.8,24.7 23.89,25.79 24.28,25.79 24.49,26 v24.95,26 v24.96,26 | 2.79,26.45 2.36,26.89 C13.1 | v22.97,19.42 22.97,20.61 22.49,21.1
  Bottom 0.178: 22.04,15.65 22.04,14.37 20.98,13.31 20.98,13.17 20.68,12.87 20.54,12.87 17.45,9.78 17.45,9.35 19.42,7.38 19.42,4.81 X1.1 | v3.89,5.88 3.89,6.95 4.06,7.11 4.06,7.7 v3.69,8.07 | v23.84,27.06 24.9,26 v24.96,26 | LED4.P$1 1.73,30.17 2.17,30.61 5.17,30.61 v6.4,29.37 | 22.04,15.65 22.04,17.1 22.97,18.03 | 22.04,15.65 | v22.97,19.42 22.97,18.03 | LED3.P$1 24.7,16.06 24.7,16.91 23.58,18.03 22.97,18.03
VREG  (via drill 0.3)
  Top 0.127: 25.68,28.09 C2.1
  Top 0.152: C2.1 25.73,28.14 C5.1 | C22.1 22.62,29.18 Q4.3
  Top 0.178: C6.1 11.04,12.85 C4.1 12.14,13.92 U$1.P$9 U$1.P$10 | C23.1 21.57,28.95 21.57,29.04 Q4.3 | v21.91,24.84 22.3,25.23 IC1.2 22.96,26.14 24.02,26.14 C3.1 24.73,27.21 24.74,27.22 24.74,27.31 25.18,27.75 | 25.18,27.75 25.53,28.09 25.68,28.09 | C22.1 23.75,29.18 25.18,27.75
  Bottom 0.178: U$1.P$10 14.96,15.18 16.26,16.49 16.26,17.67 U$1.P$12 16.23,19.16 20.96,23.89 21.64,24.57 | v21.91,24.84 21.64,24.57 | 21.64,24.57

### Text on the board
tPlace: NTA4151PT1G | JLCJLCJLCJLC
bPlace: 07/16/2020 | Optifil V4.5